# EAGLE schematic OLM-base-v.REV-3-SMT (EAGLE 6.4)
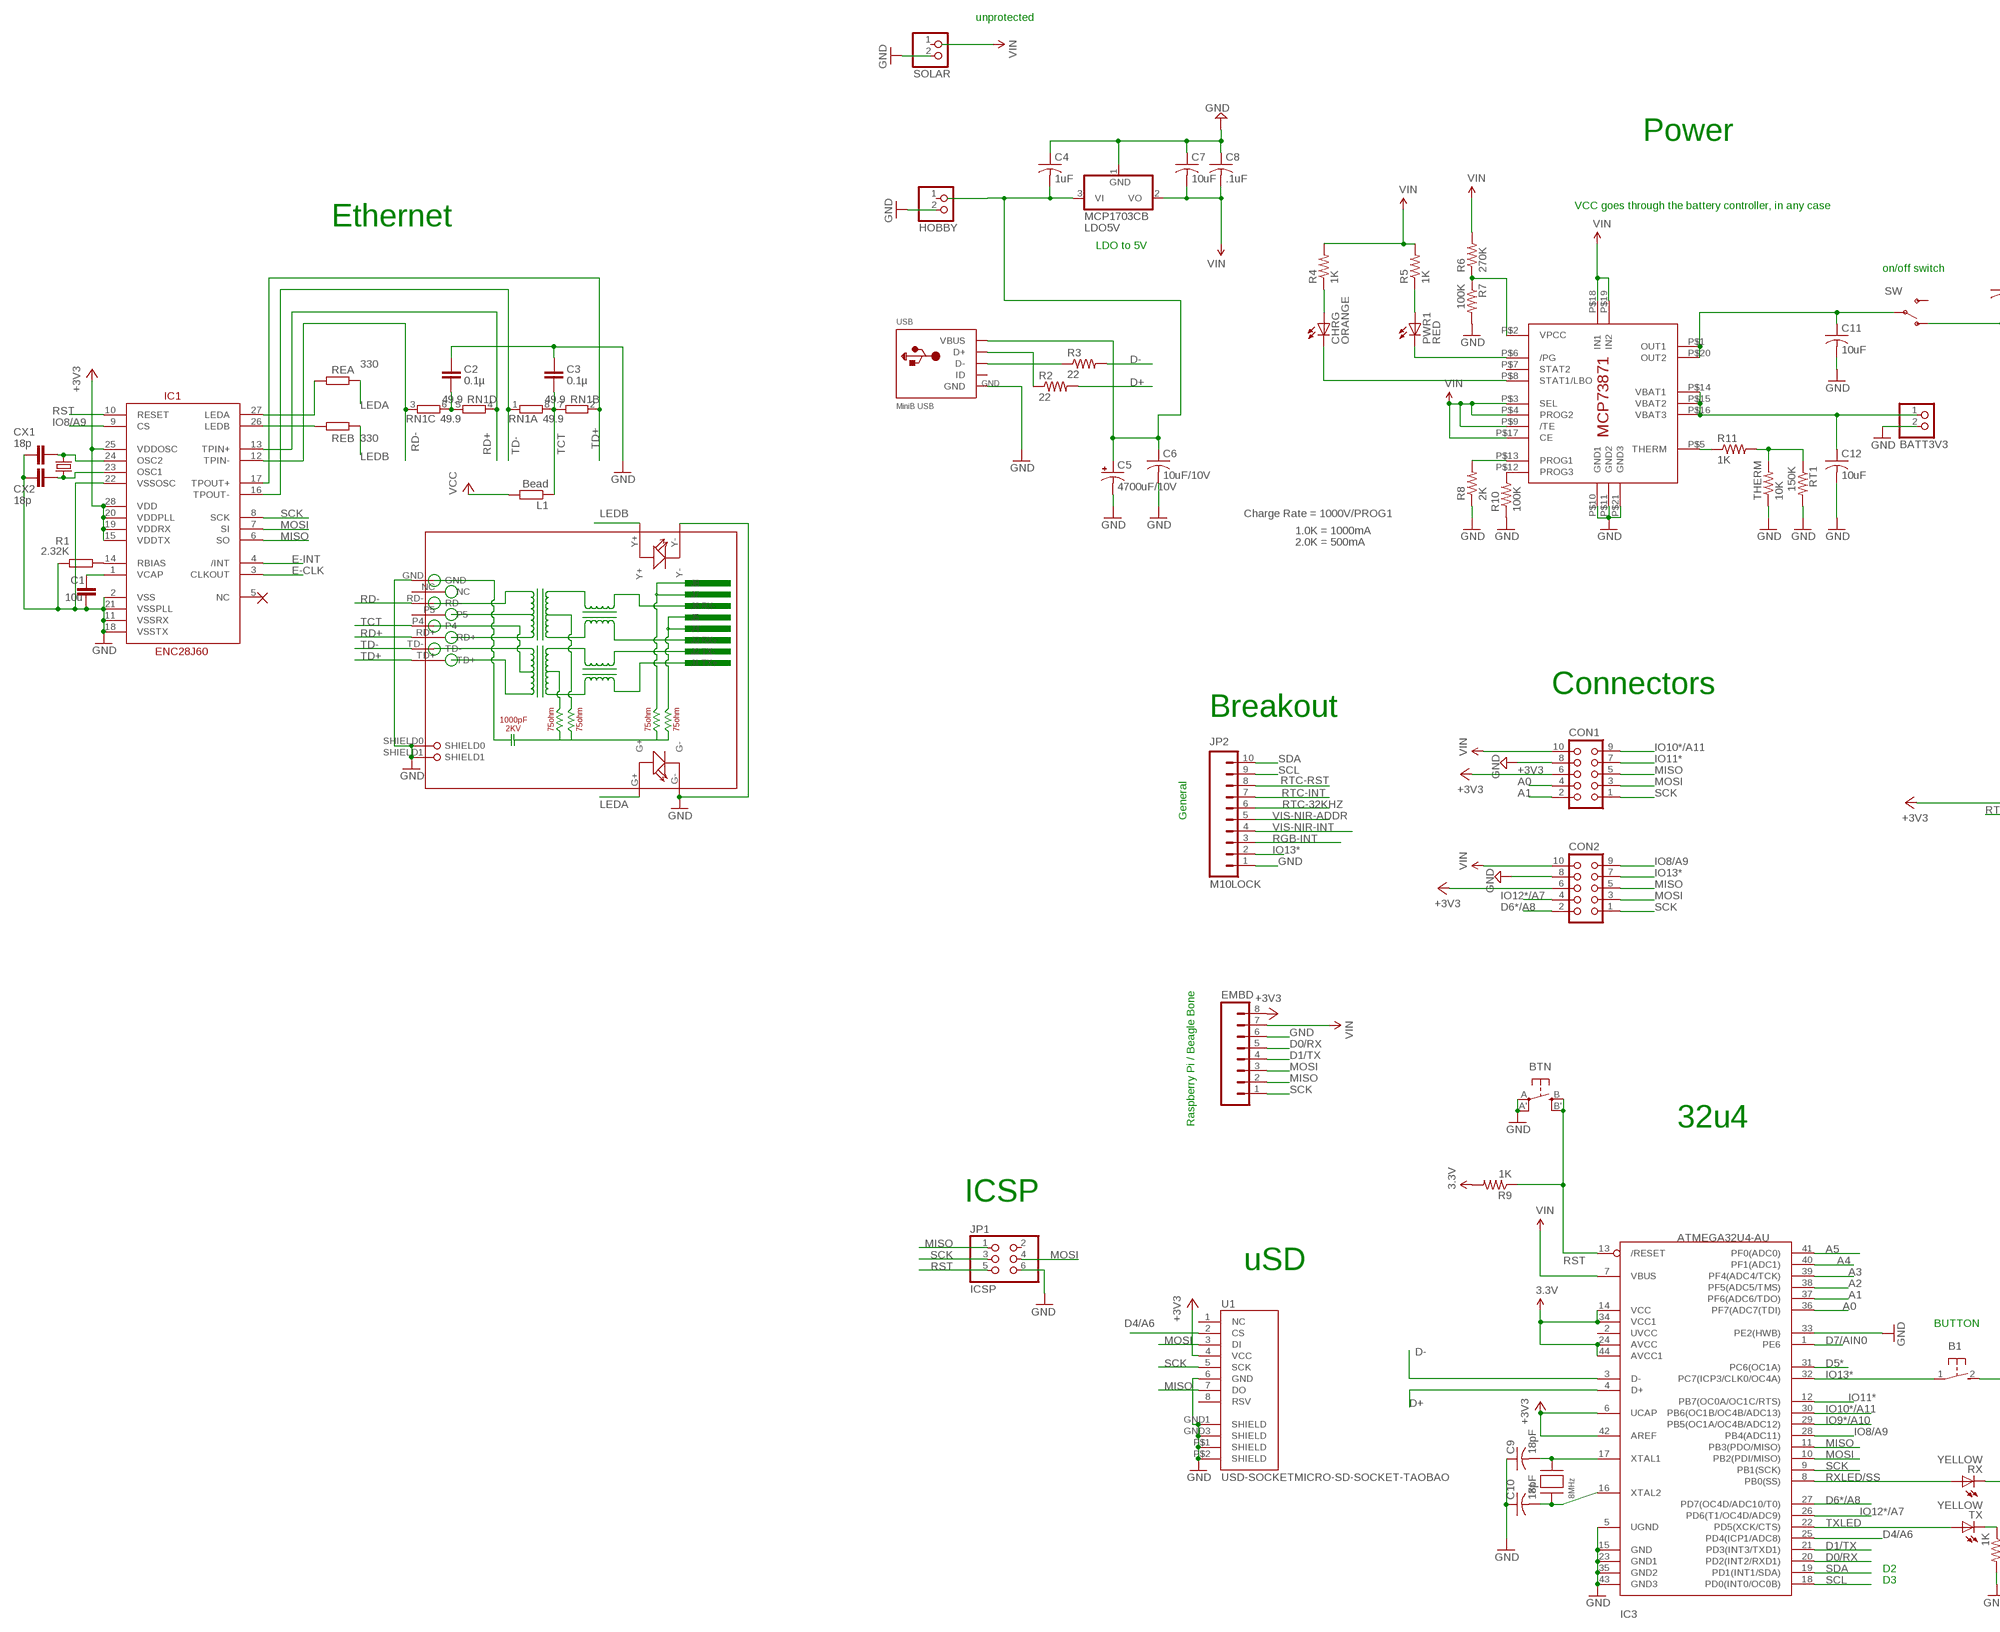
[diagram p0: schematic, sheet 1, part 1 of 2]
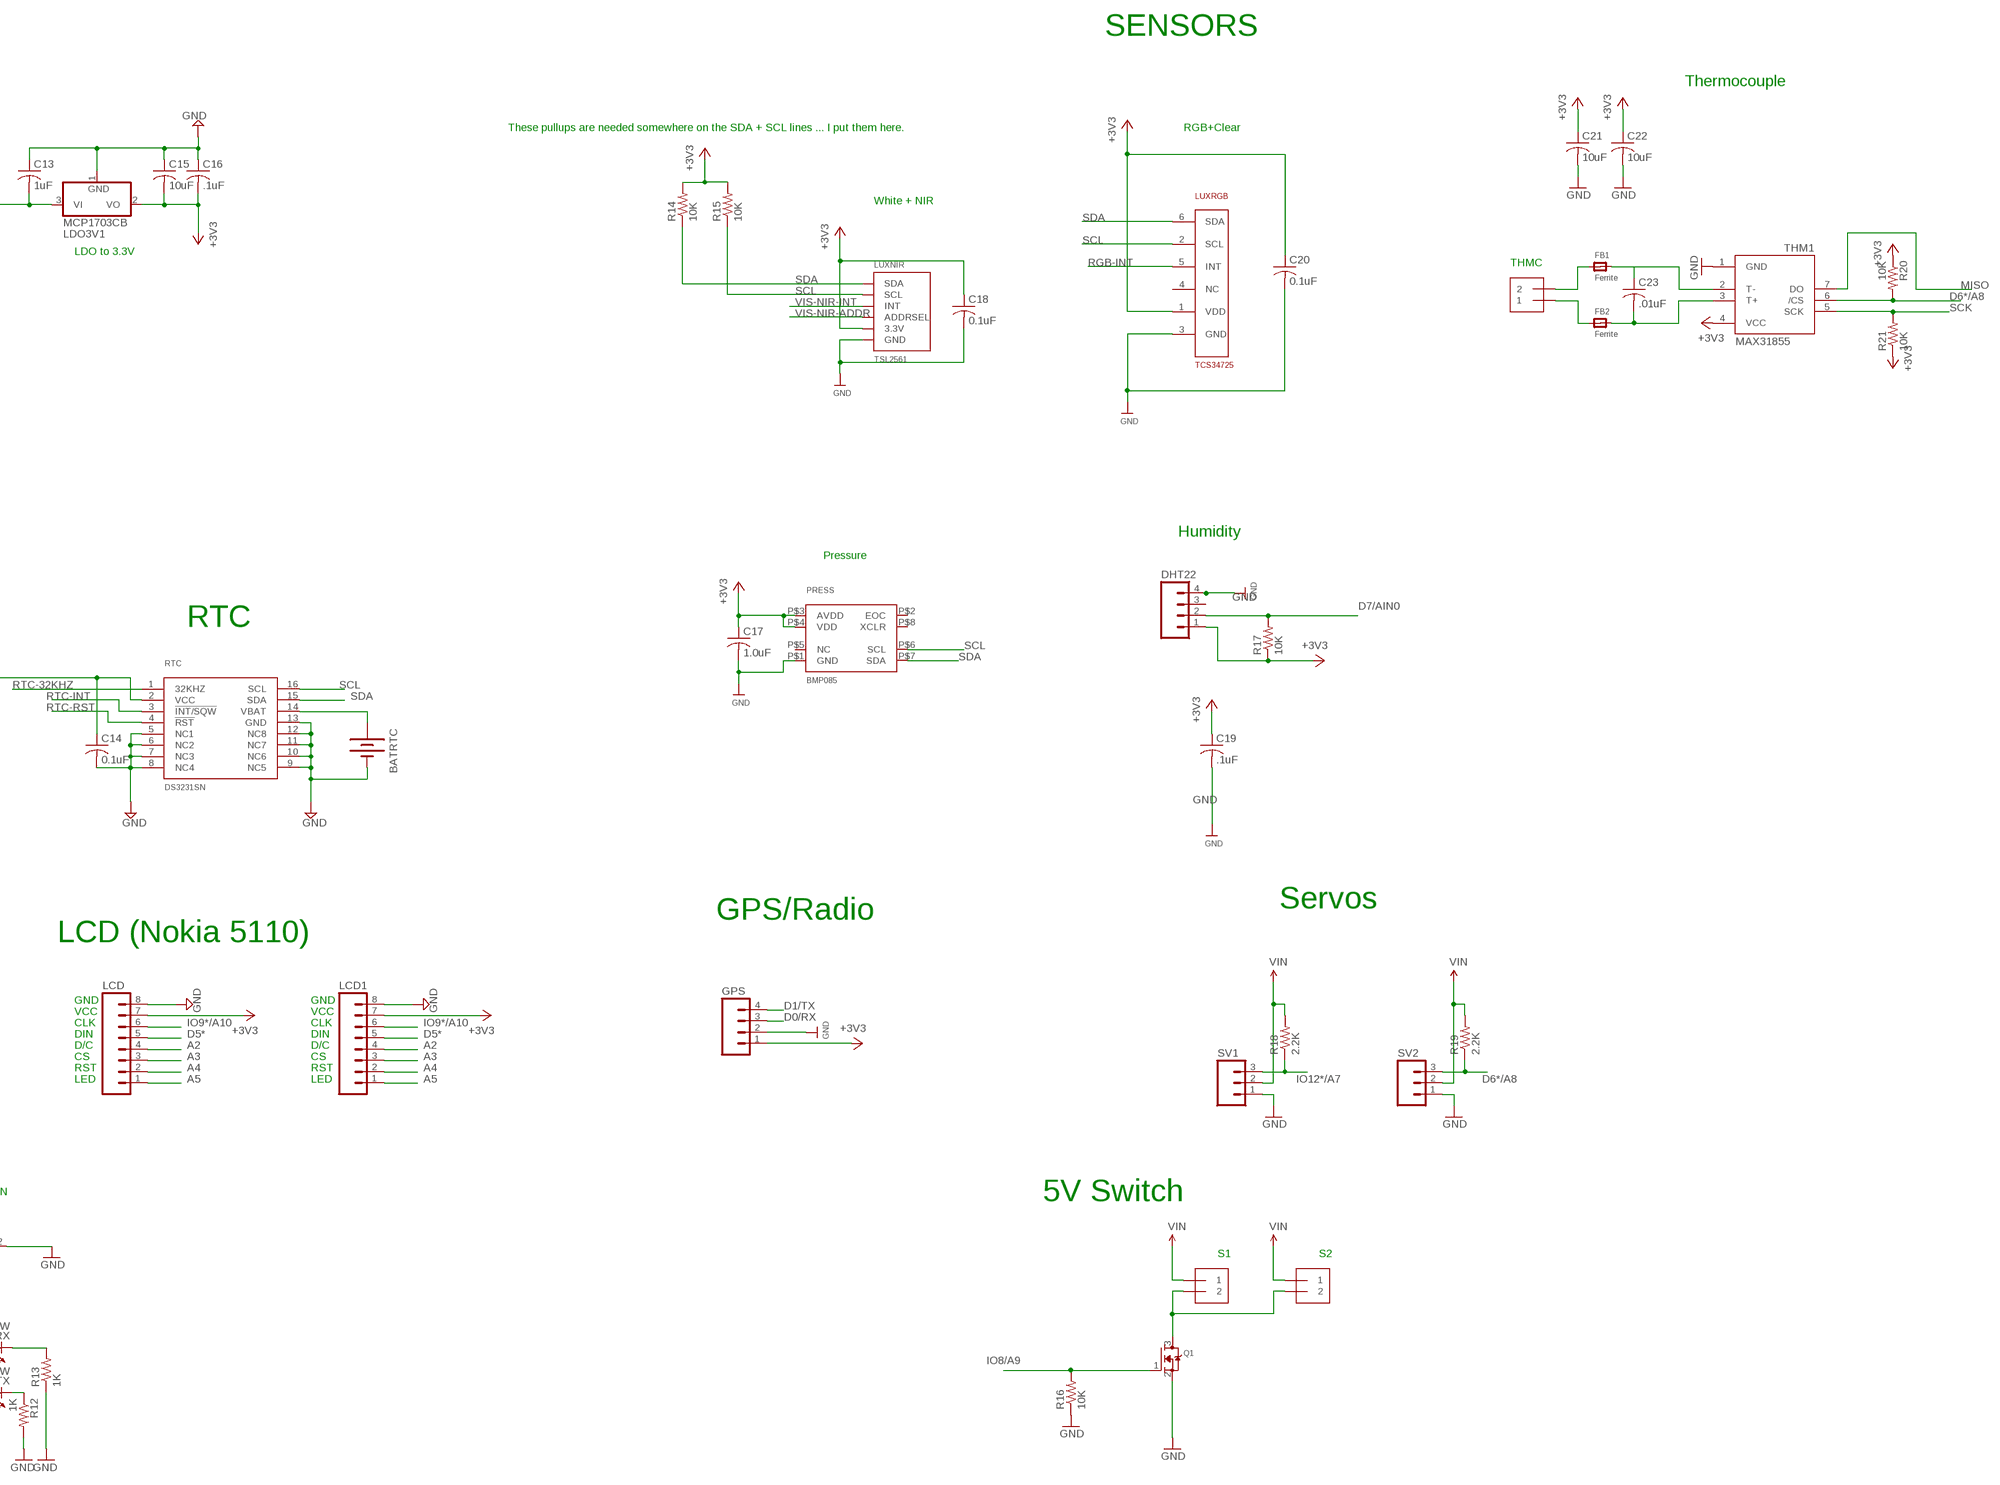
[diagram p1: schematic, sheet 1, part 2 of 2]

## Parts
B1  31-XX  [B3F-31XX]
BATRTC  BATTERYBATTERY_12MM_SMT  [BATTCON_12MM_SMT]
BATT3V3  JST_2PIN-SMT-RA  [JST-PH-2-SMT-RA]
BTN  EVQQ2  [EVQ-Q2]
C1  10u  C-EUC0805  [C0805]
C2  0.1µ  C-EUC0805  [C0805]
C3  0.1µ  C-EUC0805  [C0805]
C4  1uF  C-USC0805  [C0805]
C5  4700uF/10V  CPOL-USE5-13  [E5-13]
C6  10uF/10V  C-USC0805  [C0805]
C7  10uF  C-USC0805  [C0805]
C8  .1uF  C-USC0805  [C0805]
C9  18pF  C-USC0805  [C0805]
C10  18pF  C-USC0805  [C0805]
C11  10uF  C-USC0805  [C0805]
C12  10uF  C-USC0805  [C0805]
C13  1uF  C-USC0805  [C0805]
C14  0.1uF  C-USC0805  [C0805]
C15  10uF  C-USC0805  [C0805]
C16  .1uF  C-USC0805  [C0805]
C17  1.0uF  C-USC0805  [C0805]
C18  0.1uF  C-USC0805  [C0805]
C19  .1uF  C-USC0805  [C0805]
C20  0.1uF  C-USC0805  [C0805]
C21  10uF  C-USC0805  [C0805]
C22  10uF  C-USC0805  [C0805]
C23  .01uF  C-USC0805  [C0805]
CHRG  ORANGE  LEDCHIP-LED0805  [CHIP-LED0805]
CON1  CON10L  [CON10L]
CON2  CON10L  [CON10L]
CX1  18p  C-EUC0805  [C0805]
CX2  18p  C-EUC0805  [C0805]
DHT22  M04LOCK  [1X04_LOCK]
EMBD  M08LOCK  [1X08_LOCK]
EXTL  25MHz  CRYSTAL10.5X4.8  [CRYSTAL-SMD-10.5X4.8-2PIN]
FB1  Ferrite  FERRITE_0805  [_0805]
FB2  Ferrite  FERRITE_0805  [_0805]
GPS  M04LOCK  [1X04_LOCK]
HOBBY  JST_2PIN-SMT-RA  [JST-PH-2-SMT-RA]
IC1  ENC28J60  ENC28J60SO28LONG  [SOIC28WLONG]
IC2  MCP73871  [QFN20_4MM]
IC3  ATMEGA32U4-AU  [TQFP44]
JP1  ICSP  PINHD-2X3  [2X03]
JP2  M10LOCK  [1X10_LOCK]
L1  Bead  R-EU_R0805  [R0805]
LCD  M08LOCK  [1X08_LOCK]
LCD1  M08LOCK  [1X08_LOCK]
LDO3V1  MCP1703CB  [SOT23]
LDO5V  MCP1703CB  [SOT23]
LUXNIR  TSL2561  [TSL2561_FN@1]
LUXRGB  TCS34725  [DFN-6]
PRESS  BMP085  [BMP085]
PWR1  RED  LEDCHIP-LED0805  [CHIP-LED0805]
Q1  MOSFET-NREFLOW  [SOT23]
R1  2.32K  R-EU_R0805  [R0805]
R2  22  R-US_R0805  [R0805]
R3  22  R-US_R0805  [R0805]
R4  1K  R-US_R0805  [R0805]
R5  1K  R-US_R0805  [R0805]
R6  270K  R-US_R0805  [R0805]
R7  100K  R-US_R0805  [R0805]
R8  2K  R-US_FLIPFLOP  [0805-THM]
R9  1K  R-US_R0805  [R0805]
R10  100K  R-US_R0805  [R0805]
R11  1K  R-US_M0805  [M0805]
R12  1K  R-US_R0805  [R0805]
R13  1K  R-US_R0805  [R0805]
R14  10K  R-US_R0805  [R0805]
R15  10K  R-US_R0805  [R0805]
R16  10K  R-US_R0805  [R0805]
R17  10K  R-US_R0805  [R0805]
R18  2.2K  R-US_R0805  [R0805]
R19  2.2K  R-US_R0805  [R0805]
R20  10K  R-US_R0805  [R0805]
R21  10K  R-US_R0805  [R0805]
REA  330  R-EU_R0805  [R0805]
REB  330  R-EU_R0805  [R0805]
RJ1  HR911105A  [HR911105A]
RN1  49.9  4R-NEXB38V  [EXB38V]
RT1  150K  R-US_R0805  [R0805]
RTC  DS3231SN  [SO16W]
RX  YELLOW  LEDCHIPLED_0805  [CHIPLED_0805]
S1  1X2-3.5MM  [1X2-3.5MM]
S2  1X2-3.5MM  [1X2-3.5MM]
SOLAR  JST_2PIN-SMT-RA  [JST-PH-2-SMT-RA]
SV1  M03PTH  [1X03]
SV2  M03PTH  [1X03]
SW  SPDT  SWITCH-SPSTSMD2  [SWITCH-SPDT-SMD]
THERM  10K  R-US_FLIPFLOP  [0805-THM]
THM1  MAX31855  MAX6675  [SO08]
THMC  1X2-3.5MM  [1X2-3.5MM]
TX  YELLOW  LEDCHIPLED_0805  [CHIPLED_0805]
U1  USD-SOCKETMICRO-SD-SOCKET-TAOBAO  [MICRO-SD-SOCKET-TAOBAO]
USB  MiniB USB  USBMINIBLARGE  [USB-MINIB_LARGER]
X1  8MHz  XTALNX5032  [NX5032]

## Nets
+3V3: C14.1 C15.2 C16.2 C17.1 C18.1 C19.1 C20.1 C21.1 C22.1 CON1.6 CON2.6 DHT22.1 EMBD.8 GPS.1 IC1.15(VDDTX) IC1.19(VDDRX) IC1.20(VDDPLL) IC1.25(VDDOSC) IC1.28(VDD) IC3.6(UCAP) IC3.42(AREF) LCD1.7 LCD.7 LDO3V1.2(VO) LUXNIR.VDD(3.3V) LUXRGB.1(VDD) PRESS.P$3(AVDD) PRESS.P$4(VDD) R14.2 R15.2 R17.1 R20.1 R21.1 RTC.2(VCC) THM1.4(VCC) U1.4(VCC)
A0: CON1.4 IC3.36(PF7(ADC7(TDI))
A1: CON1.2 IC3.37(PF6(ADC6/TDO))
A2: IC3.38(PF5(ADC5/TMS)) LCD1.4 LCD.4
A3: IC3.39(PF4(ADC4/TCK)) LCD1.3 LCD.3
A4: IC3.40(PF1(ADC1)) LCD1.2 LCD.2
A5: IC3.41(PF0(ADC0)) LCD1.1 LCD.1
BATT: BATT3V3.1 C12.1 IC2.P$14(VBAT1) IC2.P$15(VBAT2) IC2.P$16(VBAT3)
D0/RX: EMBD.5 GPS.3 IC3.20(PD2(INT2/RXD1))
D1/TX: EMBD.4 GPS.4 IC3.21(PD3(INT3/TXD1))
D4/A6: IC3.25(PD4(ICP1/ADC8)) U1.2(CS)
D5*: IC3.31(PC6(OC1A)) LCD1.5 LCD.5
D6*/A8: CON2.2 IC3.27(PD7(OC4D/ADC10/T0)) R19.1 R20.2 SV2.3 THM1.6(/CS)
D7/AIN0: DHT22.2 IC3.1(PE6) R17.2
D+: IC3.4(D+) R2.2
D-: IC3.3(D-) R3.2
E-CLK: IC1.3(CLKOUT)
E-INT: IC1.4(/INT)
GND: B1.2(S) BATRTC.P$1(-) BATT3V3.2 BTN.A'(P1) BTN.A(P) C1.2 C2.1 C3.1 C4.1 C5.- C6.2 C7.1 C8.1 C9.1 C10.1 C11.2 C12.2 C13.1 C14.2 C15.1 C16.1 C17.2 C18.2 C19.2 C20.2 C21.2 C22.2 CON1.8 CON2.8 CX1.2 CX2.2 DHT22.4 EMBD.6 GPS.2 HOBBY.2 IC1.2(VSS) IC1.11(VSSRX) IC1.18(VSSTX) IC1.21(VSSPLL) IC1.22(VSSOSC) IC2.P$10(GND1) IC2.P$11(GND2) IC2.P$21(GND3) IC3.5(UGND) IC3.15(GND) IC3.23(GND1) IC3.33(PE2(HWB)) IC3.35(GND2) IC3.43(GND3) JP1.6 JP2.1 LCD1.8 LCD.8 LDO3V1.1(GND) LDO5V.1(GND) LUXNIR.VSS(GND) LUXRGB.3(GND) PRESS.P$1(GND) Q1.2(S) R1.1 R7.2 R8.1 R10.1 R12.2 R13.1 R16.1 RJ1.G- RJ1.GND RJ1.SHIELD0 RJ1.SHIELD1 RJ1.Y- RT1.2 RTC.5(NC1) RTC.6(NC2) RTC.7(NC3) RTC.8(NC4) RTC.9(NC5) RTC.10(NC6) RTC.11(NC7) RTC.12(NC8) RTC.13(GND) SOLAR.2 SV1.1 SV2.1 THERM.1 THM1.1(GND) U1.6(GND) U1.GND1(SHIELD) U1.GND3(SHIELD) U1.P$1(SHIELD) U1.P$2(SHIELD) USB.GND
HIGH-CURRENT: Q1.3(D) S1.2 S2.2
IO8/A9: CON2.9 IC1.9(CS) IC3.28(PB4(ADC11)) Q1.1(G) R16.2
IO9*/A10: IC3.29(PB5(OC1A/OC4B/ADC12)) LCD1.6 LCD.6
IO10*/A11: CON1.9 IC3.30(PB6(OC1B/OC4B/ADC13))
IO11*: CON1.7 IC3.12(PB7(OC0A/OC1C/RTS))
IO12*/A7: CON2.4 IC3.26(PD6(T1/OC4D/ADC9)) R18.1 SV1.3
IO13*: B1.1(P) CON2.7 IC3.32(PC7(ICP3/CLK0/OC4A))
LEDA: REA.2 RJ1.G+
LEDB: REB.2 RJ1.Y+
MISO: CON1.5 CON2.5 EMBD.2 IC1.6(SO) IC3.11(PB3(PDO/MISO)) JP1.1 THM1.7(DO) U1.7(DO)
MOSI: CON1.3 CON2.3 EMBD.3 IC1.7(SI) IC3.10(PB2(PDI/MISO)) JP1.4 U1.3(DI)
N$1: BATRTC.P$2(+) RTC.14(VBAT)
N$2: IC1.27(LEDA) REA.1
N$3: FB1.1 THMC.2
N$4: C23.1 FB1.2 THM1.2(T-)
N$5: FB2.1 THMC.1
N$6: C23.2 FB2.2 THM1.3(T+)
N$8: C9.2 IC3.17(XTAL1) X1.P$2
N$9: C10.2 IC3.16(XTAL2) X1.P$1
N$10: C2.2 RN1.5 RN1.6
N$11: R12.1 TX.C
N$12: R13.2 RX.C
N$15: IC1.26(LEDB) REB.1
N$16: C1.1 IC1.1(VCAP)
N$17: IC1.14(RBIAS) R1.2
N$18: CX1.1 EXTL.P$2 IC1.24(OSC2)
N$19: CX2.1 EXTL.P$1 IC1.23(OSC1)
N$20: IC2.P$2(VPCC) R6.1 R7.1
N$21: IC2.P$6(/PG) PWR1.C
N$22: C4.2 C5.+ C6.1 LDO5V.3(VI) USB.VBUS
N$29: CHRG.C IC2.P$8(STAT1/LBO)
N$30: CHRG.A R4.1
N$32: PWR1.A R5.1
N$33: IC2.P$12(PROG3) R10.2
N$34: IC2.P$13(PROG1) R8.2
N$35: C11.1 IC2.P$1(OUT1) IC2.P$20(OUT2) SW.2(P)
N$36: IC2.P$5(THERM) R11.1
N$37: R11.2 RT1.1 THERM.2
N$41: R2.1 USB.D+
N$42: R3.1 USB.D-
N$44: C13.2 LDO3V1.3(VI)
RD+: IC1.13(TPIN+) RJ1.RD+ RN1.4
RD-: IC1.12(TPIN-) RJ1.RD- RN1.3
RGB-INT: LUXRGB.5(INT)
RST: BTN.B'(S1) BTN.B(S) IC1.10(RESET) IC3.13(/RESET) JP1.5 R9.1
RTC-32KHZ: RTC.1(32KHZ)
RTC-INT: RTC.3(!INT/SQW)
RTC-RST: RTC.4(!RST)
RXLED/SS: IC3.8(PB0(SS)) RX.A
SCK: CON1.1 CON2.1 EMBD.1 IC1.8(SCK) IC3.9(PB1(SCK)) JP1.3 R21.2 THM1.5(SCK) U1.5(SCK)
SCL: IC3.18(PD0(INT0/OC0B)) JP2.9 LUXNIR.CLK(SCL) LUXRGB.2(SCL) PRESS.P$6(SCL) R15.1 RTC.16(SCL)
SDA: IC3.19(PD1(INT1/SDA)) JP2.10 LUXNIR.DATA(SDA) LUXRGB.6(SDA) PRESS.P$7(SDA) R14.1 RTC.15(SDA)
TCT: C3.2 L1.1 RJ1.P4 RN1.7 RN1.8
TD+: IC1.17(TPOUT+) RJ1.TD+ RN1.2
TD-: IC1.16(TPOUT-) RJ1.TD- RN1.1
TXLED: IC3.22(PD5(XCK/CTS)) TX.A
VCC: IC3.14(VCC) IC3.24(AVCC) IC3.34(VCC1) IC3.44(AVCC1) L1.2 R9.2 ; supply symbol labelled 3.3V
VIN: C7.2 C8.2 CON1.10 CON2.10 EMBD.7 IC2.P$3(SEL) IC2.P$4(PROG2) IC2.P$9(/TE) IC2.P$17(CE) IC2.P$18(IN1) IC2.P$19(IN2) IC3.7(VBUS) LDO5V.2(VO) R4.2 R5.2 R6.2 R18.2 R19.2 S1.1 S2.1 SV1.2 SV2.2
VIS-NIR-ADDR: LUXNIR.ADR(ADDRSEL)
VIS-NIR-INT: LUXNIR.INT
Unconnected: DHT22.3 HOBBY.1 IC1.5(NC) IC2.P$7(STAT2) IC3.2(UVCC) JP1.2 JP2.2 JP2.3 JP2.4 JP2.5 JP2.6 JP2.7 JP2.8 LUXRGB.4(NC) PRESS.P$2(EOC) PRESS.P$5(NC) PRESS.P$8(XCLR) RJ1.NC RJ1.P5 SOLAR.1 SW.1(O) SW.3(S) U1.1(NC) U1.8(RSV) USB.ID

## Notes on the sheet
- unprotected
- Power
- SENSORS
- Thermocouple
- VCC goes through the battery controller, in any case
- Ethernet
- LDO to 5V | These pullups are needed somewhere on the SDA + SCL lines ... I put them here. | RGB+Clear
- on/off switch
- White + NIR
- LDO to 3.3V
- THMC
- Charge Rate = 1000V/PROG1
- 1.0K = 1000mA
- 2.0K = 500mA
- Humidity
- Pressure
- Connectors
- Breakout
- RTC
- General
- Raspberry Pi / Beagle Bone
- Servos
- GPS/Radio
- LCD (Nokia 5110)
- 32u4
- GND | GND
- VCC | VCC
- CLK | CLK
- DIN | DIN
- D/C | D/C
- CS | CS
- ICSP | RST | RST
- LED | LED
- uSD
- BUTTON
- 5V Switch
- S1 | S2
- D2
- D3

## Library data of the parts
B1 = adafruit:31-XX: OMRON SWITCH Now with beefier pads!
BATRTC = SparkFunNew:BATTERY: Battery Holders Various common sizes : AA, AAA, 20mm coin cell and 12mm coin cell.
BATT3V3 HOBBY SOLAR = adafruit:JST_2PIN: JST 2-Pin Connectors of various flavors SMT-RA (S2B-PH-SM4) 4UConnector #17311 SMT (B2B-PH-SM4) THM-RA (S2B-PH) THM (B2B-PH)
BTN = adafruit:EVQQ2: SMT 6mm switch, EVQQ2 series http://www.ladyada.net/library/eagle
C1-C3 CX1 CX2 = resistor:C-EU: CAPACITOR, European symbol
C4 C6-C13 C15-C23 = adafruit:C-US: CAPACITOR, American symbol
C5 = adafruit:CPOL-US: POLARIZED CAPACITOR, American symbol
C14 = rcl:C-US: CAPACITOR, American symbol
CHRG PWR1 RX TX = adafruit:LED: LED OSRAM: - CHIPLED LG R971, LG N971, LY N971, LG Q971, LY Q971, LO R971, LY R971 LH N974, LH R974 LS Q976, LO Q976, LY Q976 LO Q996 - Hyper CHIPLED LW Q18S LB Q993, LB Q99A, LB R99A - SideLED LS A670, LO A670, LY A670, LG A670, LP A670 LB A673, LV A673, LT A673, LW A673 LH A674 LY A675 LS A676, LA A676, LO A676, LY A676, LW A676 LS A679, LY A679, LG A679 - Hyper Micro SIDELED® LS Y876, LA Y876, LO Y876, LY Y876 LT Y87S - SmartLED LW L88C, LW L88S LB L89C, LB L89S, LG L890 LS L89K, LO L89K, LY L89K LS L896, LA L896, LO L896, LY L896 - TOPLED LS T670, LO T670, LY T670, LG T670, LP T670 LSG T670, LSP T670, LSY T670, LOP T670, LYG T670 LG T671, LOG T671, LSG T671 LB T673, LV T673, LT T673, LW T673 LH T674 LS T676, LA T676, LO T676, LY T676, LB T676, LH T676, LSB T676, LW T676 LB T67C, LV T67C, LT T67C, LS T67K, LO T67K, LY T67K, LW E67C LS E67B, LA E67B, LO E67B, LY E67B, LB E67C, LV E67C, LT E67C LW T67C LS T679, LY T679, LG T679 LS T770, LO T770, LY T770, LG T770, LP T770 LB T773, LV T773, LT T773, LW T773 LH T774 LS E675, LA E675, LY E675, LS T675 LS T776, LA T776, LO T776, LY T776, LB T776 LHGB T686 LT T68C, LB T68C - Hyper Mini TOPLED® LB M676 - Mini TOPLED Santana® LG M470 LS M47K, LO M47K, LY M47K Source: http://www.osram.convergy.de/
CON1 CON2 = con-harting:CON10L: CONNECTOR; OC_FARNELL: unknown; OC_NEWARK: unknown
DHT22 GPS = SparkFun-Connectors:M04: Header 4 Standard 4-pin 0.1" header. Use with straight break away headers (SKU : PRT-00116), right angle break away headers (PRT-00553), swiss pins (PRT-00743), machine pins (PRT-00117), and female headers (PRT-00115). Molex polarized connector foot print use with SKU : PRT-08231 with associated crimp pins and housings. 1MM SMD Version SKU: PRT-10208
EMBD LCD LCD1 = SparkFun-Connectors:M08: Header 8 Standard 8-pin 0.1" header. Use with straight break away headers (SKU : PRT-00116), right angle break away headers (PRT-00553), swiss pins (PRT-00743), machine pins (PRT-00117), and female headers (PRT-00115).
EXTL = SparkFun:CRYSTAL: Crystals Various standard crystals. Proven footprints. Spark Fun Electronics SKU : COM-00534
FB1 FB2 = microbuilder:FERRITE: Ferrite Bead 0603 MMZ1608B121C - 120 Ohm @ 100MHz, 600mA, 0.15 Ohm DC Resistance - Digikey: 445-2164-1-ND BK1608HW121-T - 120 Ohm, 600mA Ferrite Chip - Digikey: 587-1876-2-ND 0805 HZ0805B272R-10 - 2.7K Ohm @ 100MHz, 200mA, 0.8 Ohm DC Resistance - Digikey: 240-2504-1-ND (see also Murata BLM21BD272SN1L) MMZ2012Y152B - 1.5K Ohm @ 100MHz, 500mA, 0.4 Ohm DC Resistance - Digikey: 445-1560-1-ND - Mainly for high frequency (80-400MHz) MMZ2012R102A - 1K Ohm @ 100MHz, 500mA, 0.3 Ohm DC Resistance - Digikey: 445-1555-2-ND - More general purpose (10-200MHz)
IC1 = SparkFun:ENC28J60
IC2 = adafruit:MCP73871
IC3 = adaprog:ATMEGA32U4
JP1 = pinhead:PINHD-2X3: PIN HEADER
JP2 = SparkFun-Connectors:M10: Header 10 Standard 10-pin 0.1" header. Use with straight break away headers (SKU : PRT-00116), right angle break away headers (PRT-00553), swiss pins (PRT-00743), machine pins (PRT-00117), and female headers (PRT-00115).
L1 R1 REA REB = rcl:R-EU_: RESISTOR, European symbol
LDO3V1 LDO5V = linear:MCP1703: 250 mA, 16V, Low Quiescent Current LDO Regulator Source: http://ww1.microchip.com/downloads/en/DeviceDoc/22049b.pdf
LUXNIR = microbuilder:TSL2561: TSL2561 Light-To-Digital Sensor Mouser Part Numbers: CS (obsolete): 856-TSL2561CS DFN (cheapest): 856-TSL2561FN
LUXRGB = dwbLibrary:TCS34725
PRESS = microbuilder:BMP085: BMP085 Digital Pressure Sensor 1.8-3.6V Supply, I2C Interface
Q1 = adafruit:MOSFET-N: N-Channel Mosfet 2N7002E - 60V 260mA SOT23 [Digikey: 2N7002ET1GOSTR-ND] - REEL BSH103 - 30V 850mA SOT23 [Digikey: 568-5013-1-ND]
R2-R21 RT1 THERM = adafruit:R-US_: RESISTOR, American symbol
RJ1 = CONNECTER:HR911105A
RN1 = resistor-dil:4R-N: Array Chip Resistor Source: RS Component / Phycomp; OC_FARNELL: unknown; OC_NEWARK: unknown
RTC = comfile:DS3231SN
S1 S2 THMC = adafruit:1X2: 3.5mm Terminal block http://www.ladyada.net/library/pcb/eaglelibrary.html
SV1 SV2 = SparkFun:M03: Header 3 Standard 3-pin 0.1" header. Use with straight break away headers (SKU : PRT-00116), right angle break away headers (PRT-00553), swiss pins (PRT-00743), machine pins (PRT-00117), and female headers (PRT-00115). Molex polarized connector foot print use with SKU : PRT-08232 with associated crimp pins and housings.
SW = SparkFun:SWITCH-SPST: SPST Switch Simple slide switch. Spark Fun Electronics SKU : COM-00102
THM1 = adafruit:MAX6675
U1 = SparkFunNew:USD-SOCKET: microSD Socket Push-push type uSD socket. Schematic element and footprint production proven. Spark Fun Electronics SKU : PRT-00127. tDoc lines correctly indicate media card edge positions when inserting (unlocked, locked, depressed).
USB = microbuilder:USB: USB Connectors USBMINIB - Surface Mount Female Mini-B USB Connector 4UConnector: 06564
X1 = adaprog:XTAL

## Net classes
0 default: width 0.254 mm, clearance 0.203 mm
1 power: width 0.61 mm, clearance 0.203 mm